# Altium schematic sheet IQ_modulator.SchDoc
size B; SheetNumber: 2; SheetTotal: 5
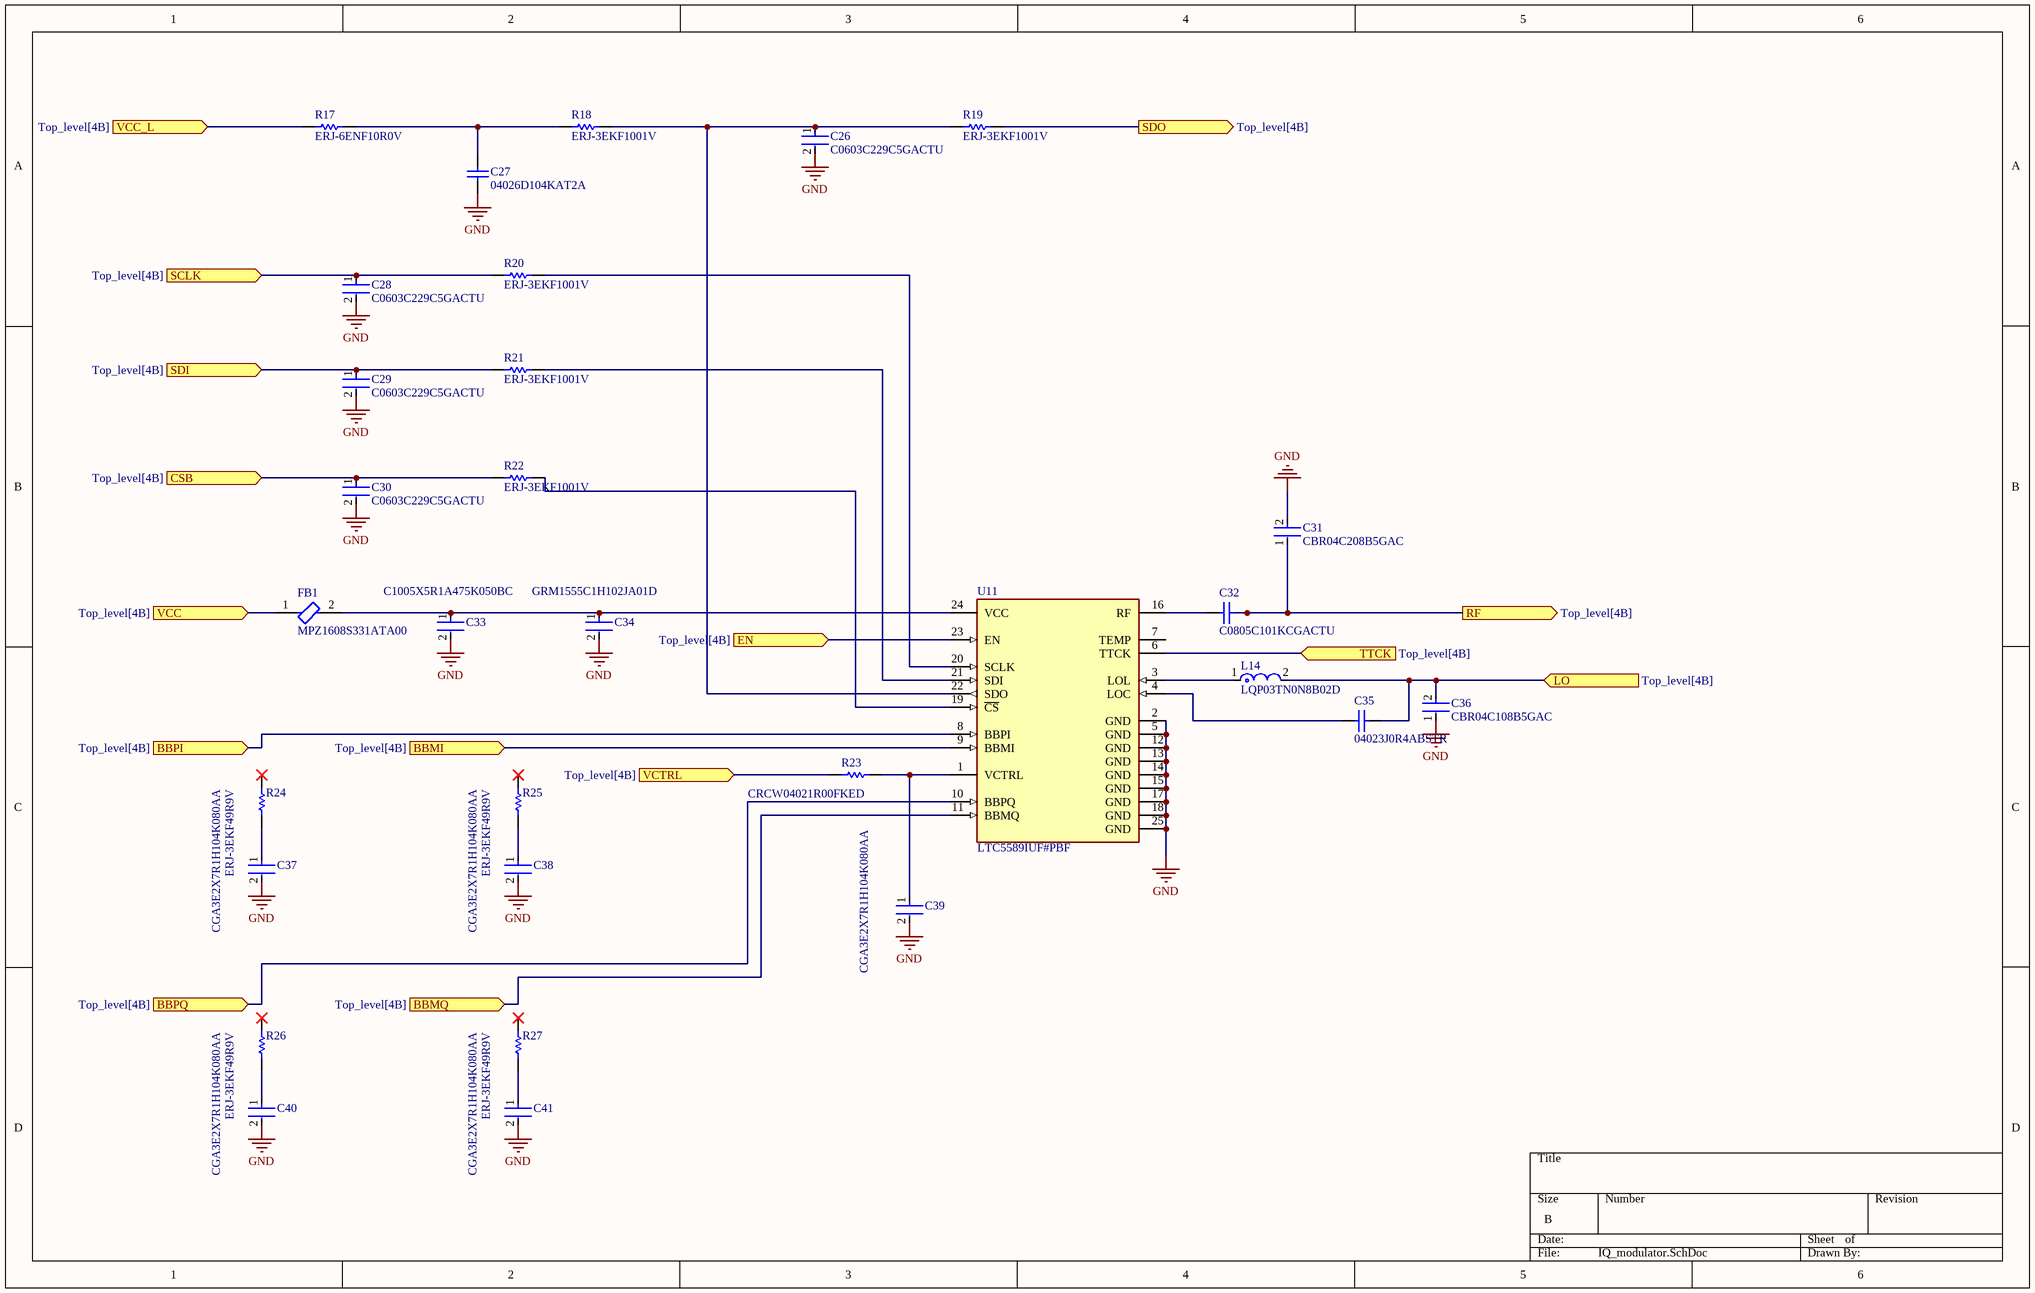
[diagram p0: IQ_modulator.SchDoc]

## Parts
C26  C0603C229C5GACTU  [FP-C0603C-CF-MFG]
C27  04026D104KAT2A  [CAPC1005X56X25LL10T15]
C28  C0603C229C5GACTU  [FP-C0603C-CF-MFG]
C29  C0603C229C5GACTU  [FP-C0603C-CF-MFG]
C30  C0603C229C5GACTU  [FP-C0603C-CF-MFG]
C31  CBR04C208B5GAC  [FP-CBR04C-MFG]
C32  C0805C101KCGACTU  [CAPC2013X140X50NL20T25]
C33  C1005X5R1A475K050BC  [FP-C1005-050-0_15-MFG]
C34  GRM1555C1H102JA01D  [FP-GRM155-0_05-IPC_B]
C35  04023J0R4ABSTR  [CAPC1006X50X20LL10T10]
C36  CBR04C108B5GAC  [FP-CBR04C-MFG]
C37  CGA3E2X7R1H104K080AA  [FP-CGA3E-0_3-0_1-IPC_A]
C38  CGA3E2X7R1H104K080AA  [FP-CGA3E-0_3-0_1-IPC_A]
C39  CGA3E2X7R1H104K080AA  [FP-CGA3E-0_3-0_1-IPC_A]
C40  CGA3E2X7R1H104K080AA  [FP-CGA3E-0_3-0_1-IPC_A]
C41  CGA3E2X7R1H104K080AA  [FP-CGA3E-0_3-0_1-IPC_A]
FB1  MPZ1608S331ATA00  [FP-MPZ1608-0_8-IPC_C]
L14  LQP03TN0N8B02D  [FP-LQP03TG_02-MFG]
R17  ERJ-6ENF10R0V  [RESC2013X70X40NL20T20]
R18  ERJ-3EKF1001V  [RESC1608X55X30LL15T15]
R19  ERJ-3EKF1001V  [RESC1608X55X30LL15T15]
R20  ERJ-3EKF1001V  [RESC1608X55X30LL15T15]
R21  ERJ-3EKF1001V  [RESC1608X55X30LL15T15]
R22  ERJ-3EKF1001V  [RESC1608X55X30LL15T15]
R23  CRCW04021R00FKED  [RESC1005X40X25ML05T05]
R24  ERJ-3EKF49R9V  [RESC1608X55X30ML15T15]
R25  ERJ-3EKF49R9V  [RESC1608X55X30ML15T15]
R26  ERJ-3EKF49R9V  [RESC1608X55X30ML15T15]
R27  ERJ-3EKF49R9V  [RESC1608X55X30ML15T15]
U11  LTC5589IUF#PBF  [FP-UF-24-05-08-1697-MFG]

## Ports
BBMI (in, see Top_level[4B]), BBMQ (in, see Top_level[4B]), BBPI (in, see Top_level[4B]), BBPQ (in, see Top_level[4B]), CSB (in, see Top_level[4B]), EN (in, see Top_level[4B]), LO (in, see Top_level[4B]), RF (out, see Top_level[4B]), SCLK (in, see Top_level[4B]), SDI (in, see Top_level[4B]), SDO (out, see Top_level[4B]), TTCK (in, see Top_level[4B]), VCC (in, see Top_level[4B]), VCC_L (in, see Top_level[4B]), VCTRL (in, see Top_level[4B])

## Nets
GND: C26.2 C27.1 C28.2 C29.2 C30.2 C31.2 C33.2 C34.2 C36.1 C37.2 C38.2 C39.2 C40.2 C41.2 U11.2(GND) U11.5(GND) U11.12(GND) U11.13(GND) U11.14(GND) U11.15(GND) U11.17(GND) U11.18(GND) U11.25(GND)
BBMI: U11.9(BBMI) ; port BBMI
BBMQ: U11.11(BBMQ) ; port BBMQ
BBPI: U11.8(BBPI) ; port BBPI
BBPQ: U11.10(BBPQ) ; port BBPQ
CSB: C30.1 R22.1 ; port CSB
EN: U11.23(EN) ; port EN
LO: C35.2 C36.2 L14.2 ; port LO
RF: C31.1 C32.2 ; port RF
SCLK: C28.1 R20.1 ; port SCLK
SDI: C29.1 R21.1 ; port SDI
SDO: R19.2 ; port SDO
TTCK: U11.6(TTCK) ; port TTCK
VCC: FB1.1 ; port VCC
VCC_L: R17.1 ; port VCC_L
VCTRL: R23.1 ; port VCTRL
NetC26_1: C26.1 R18.2 R19.1 U11.22(SDO)
NetC27_2: C27.2 R17.2 R18.1
NetC32_1: C32.1 U11.16(RF)
NetC33_1: C33.1 C34.1 FB1.2 U11.24(VCC)
NetC35_1: C35.1 U11.4(LOC)
NetC37_1: C37.1 R24.1
NetC38_1: C38.1 R25.1
NetC39_1: C39.1 R23.2 U11.1(VCTRL)
NetC40_1: C40.1 R26.1
NetC41_1: C41.1 R27.1
NetL14_1: L14.1 U11.3(LOL)
NetR20_2: R20.2 U11.20(SCLK)
NetR21_2: R21.2 U11.21(SDI)
NetR22_2: R22.2 U11.19(~{CS})

Not connected (* = marked no-connect by the designer): R24 2*; R25 2*; R26 2*; R27 2*; U11 7(TEMP)

## Library data of the parts
C26 C28-C30 = CMP-1035-00158-3: CAP CER 2.2PF 50V NP0 0603; Manufacturer: KEMET; Automotive Grade: Grade 1; Temperature Coefficient: 30ppm/°C; Temperature Characteristic: C0G; Tolerance: 0.25 pF; Material: Ceramic; Lead Free: Yes; Value: 2.2 pF; Voltage Rating: 50 V; Package: C0603C-CF; Category: Cap; RoHS: TRUE; ComponentLink2Description: Datasheet; Capacitance: 2.2 pF; Device Class L2: Capacitors; Digikey Description: CAP CER 2.2PF 50V NP0 0603; Temperature: -55°C to +125°C; Temperature Range Low: -55°C; Mouser Description: Multilayer Ceramic Capacitors MLCC - SMD/SMT 50volts 2.2pF C0G 0.25%; ComponentLink2URL: https://api.kemet.com/component-edge/download/datasheet/C0603C100J5GACAUTO.pdf; Temperature Range High: +125°C; Height: 0.87mm; Manufacturer Part Number: C0603C229C5GACTU; Automotive: Yes; Device Class L1: Passive Components; Octopart: https://octopart.com/c0603c229c5gactu-kemet-3874912; Device Class L3: Ceramic Capacitors
C27 = CMP-2008-02743-1: Manufacturer: AVX Interconnect / Elco; Part Number: 04026D104KAT2A
C31 = CMP-2008-00010-2: CAP CER 0.2PF 50V C0G/NP0 0402; Manufacturer: KEMET; Tolerance: 0.1 pF; Temperature Characteristic: C0G; Material: Ceramic; Temperature Coefficient: 30ppm/°C; Package: CBR04C; Temperature: -55°C to +125°C; Capacitance: 0.2 pF; Device Class L1: Passive Components; Automotive: No; Digikey Description: CAP CER 0.2PF 50V C0G/NP0 0402; Temperature Range Low: -55°C; Device Class L2: Capacitors; Octopart: https://octopart.com/cbr04c208b5gac-kemet-20446743; Height: 0.55mm; Ipc Land Pattern Name: CAPC10050X50; Manufacturer Part Number: CBR04C208B5GAC; Temperature Range High: +125°C; Voltage Rating: 50 V; Category: Cap; Lead Free: Yes; Value: 0.2 pF; ComponentLink2URL: https://content.kemet.com/datasheets/KEM_C1030_CBR_SMD.pdf; Device Class L3: Ceramic Capacitors; ComponentLink2Description: Datasheet; RoHS: TRUE; Mouser Description: Multilayer Ceramic Capacitors MLCC - SMD/SMT 50volts .2pF C0G 0402 .1pF Tol RF
C32 = CMP-2007-03324-1: Manufacturer: Kemet; Part Number: C0805C101KCGACTU
C33 = CMP-2000-05997-2: CAP CER 4.7UF 10V X5R 0402; Dielectric Material: Ceramic; Tolerance: 10%; Series: C; Package Quantity: 10000; Max Operating Temperature: 85°C; Case Code (Imperial): 0402; Lead Free: Lead Free; Voltage Rating (DC): 10V; Packaging: Cut Tape; Voltage Rating: 10V; Min Operating Temperature: -55°C; Dielectric: X5R; Thickness: 0.022inch; Width: 0.02inch; Case/Package: 0402; Case Code (Metric): 1005; Capacitance: 4.7uF; Length: 0.039inch; RoHS Compliant: Yes; REACH SVHC: No SVHC; Mount: Surface Mount
C34 = CMP-2008-04254-2: Chip Multilayer Ceramic Capacitors for General Purpose, 0402, 1000pF, C0G, 30ppm/°C, 5%, 50V; Insulation Resistance: 10GR; Capacitance: 1nF; Packaging: Tape and Reel; Lead Free: Lead Free; Tolerance: 5%; Temperature Coefficient: 30ppm/°C; Thickness: 0.022inch; Termination: SMD/SMT; Max Operating Temperature: 125°C; Height: 0.5mm; Package Quantity: 1; Radiation Hardening: No; Material: Ceramic; Case Code (Metric): 1005; Number of Pins: 2; Voltage Rating: 50V; Mount: Surface Mount; Voltage: 50V; Case/Package: 0402; Min Operating Temperature: -55°C; Dielectric Material: Ceramic; Width: 0.5mm; Depth: 0.5mm; Case Code (Imperial): 0402; REACH SVHC: No SVHC; Dielectric: C0G; Voltage Rating (DC): 50V; Length: 1mm
C35 = CMP-2008-04709-1: Manufacturer: AVX Interconnect / Elco; Part Number: 04023J0R4ABSTR
C36 = CMP-2008-00002-2: CAP CER 0.1PF 50V C0G/NP0 0402; Manufacturer: KEMET; Temperature Characteristic: C0G; Temperature Coefficient: 30ppm/°C; Material: Ceramic; Value: 0.1 pF; RoHS: TRUE; Mouser Description: Cap Ceramic 0.1pF 50V C0G 0.1pF SMD 0402 125°C Punched Paper T/R; Ipc Land Pattern Name: CAPC10050X50; Temperature Range High: +125°C; Lead Free: Yes; Device Class L1: Passive Components; Octopart: https://octopart.com/cbr04c108b5gac-kemet-20446735; Tolerance: 0.1 pF; Height: 0.55mm; Temperature: -55°C to +125°C; ComponentLink2Description: Datasheet; Voltage Rating: 50 V; Device Class L2: Capacitors; Temperature Range Low: -55°C; Category: Cap; Package: CBR04C; Automotive: No; Device Class L3: Ceramic Capacitors; Digikey Description: CAP CER 0.1PF 50V C0G/NP0 0402; ComponentLink2URL: https://content.kemet.com/datasheets/KEM_C1030_CBR_SMD.pdf; Capacitance: 0.1 pF; Manufacturer Part Number: CBR04C108B5GAC
C37-C41 = CMP-2000-07546-2: Cap Ceramic 100nF 50V X7R 10% Pad SMD 0603 +125°C Automotive T/R; Weight: 7.1E-05oz; Composition: Ceramic; Max Operating Temperature: 125°C; Termination: SMD/SMT; Dielectric: X7R; Length: 1.6mm; Package Quantity: 1; REACH SVHC: No SVHC; Lead Free: Lead Free; Case Code (Metric): 1608; Min Operating Temperature: -55°C; Packaging: Tape and Reel; Tolerance: 10%; Voltage Rating: 50V; Case Code (Imperial): 0603; Capacitance: 100nF; Case/Package: 0603; Voltage Rating (DC): 50V; Depth: 0.8mm; Radiation Hardening: No; Ratings: AEC-Q200; Mount: Surface Mount; Voltage: 50V; Thickness: 0.035inch; Width: 0.8mm; Height: 0.8mm
FB1 = CMP-08257-000202-1: Power line Ferrite Bead 330Ω @ 100MHz 1.7A DCR 0.08Ω SMD 0603; Impedance: 330R; DC Resistance (DCR): 80mR; Tolerance: 25%; Mount: Surface Mount; Current Rating: 1.7A; Case Code (Metric): 1608; REACH SVHC: No SVHC; Package Quantity: 1; Core Material: Ferrite; Lead Free: Lead Free; Case Code (Imperial): 0603; Max DC Current: 1.7A; Length: 0.063inch; Height: 0.037inch; RoHS Compliant: Yes; Width: 0.031inch; Packaging: Tape and Reel; Case/Package: 0603
L14 = CMP-06042-004201-1: Film type RF Inductor 0.8nH ±0.1nH 800mA 0.08Ω 0201 (0603); DC Resistance (DCR): 80mR; Self Resonant Frequency: 6GHz; Shielding: Unshielded; Core Material: Non-Magnetic; Current: 600mA; Q Factor: 14; Test Frequency: 500MHz; Case/Package: 0201; Packaging: Tape and Reel; Inductance: 0.8nH; Max Operating Temperature: 125°C; Depth: 0.33mm; Width: 0.012inch; Case Code (Metric): 0603; Min Operating Temperature: -55°C; Resistor Type: Thin Film; Military Standard: Not; Max DC Current: 800mA; Height: 0.3mm; Current Rating: 800mA; Length: 0.024inch; Height - Seated (Max): 0.013inch; Package Quantity: 15000; Termination: SMD/SMT; Radiation Hardening: No; Mount: Surface Mount; DC Current: 800mA; Case Code (Imperial): 0201
R17 = CMP-1013-00284-2: Manufacturer: Panasonic; Part Number: ERJ-6ENF10R0V
R18-R22 = CMP-2000-00180-1: Manufacturer: Panasonic; Part Number: ERJ-3EKF1001V
R23 = CMP-2002-08342-1: Manufacturer: Vishay Dale; Part Number: CRCW04021R00FKED
R24-R27 = CMP-2000-00538-1: Manufacturer: Panasonic; Part Number: ERJ-3EKF49R9V
U11 = CMP-09141-000283-1: RF MODULATOR 700MHZ-6GHZ 24WFQFN; Max Frequency: 6GHz; Max Supply Voltage: 3.6V; Min Frequency: 700MHz; Min Supply Voltage: 2.7V; Case/Package: QFN; Number of Pins: 24; Min Operating Temperature: -40°C; Max Operating Temperature: 105°C; RoHS Compliant: Yes; REACH SVHC: No SVHC